# Altium schematic sheet Sheet1.SchDoc
size A4
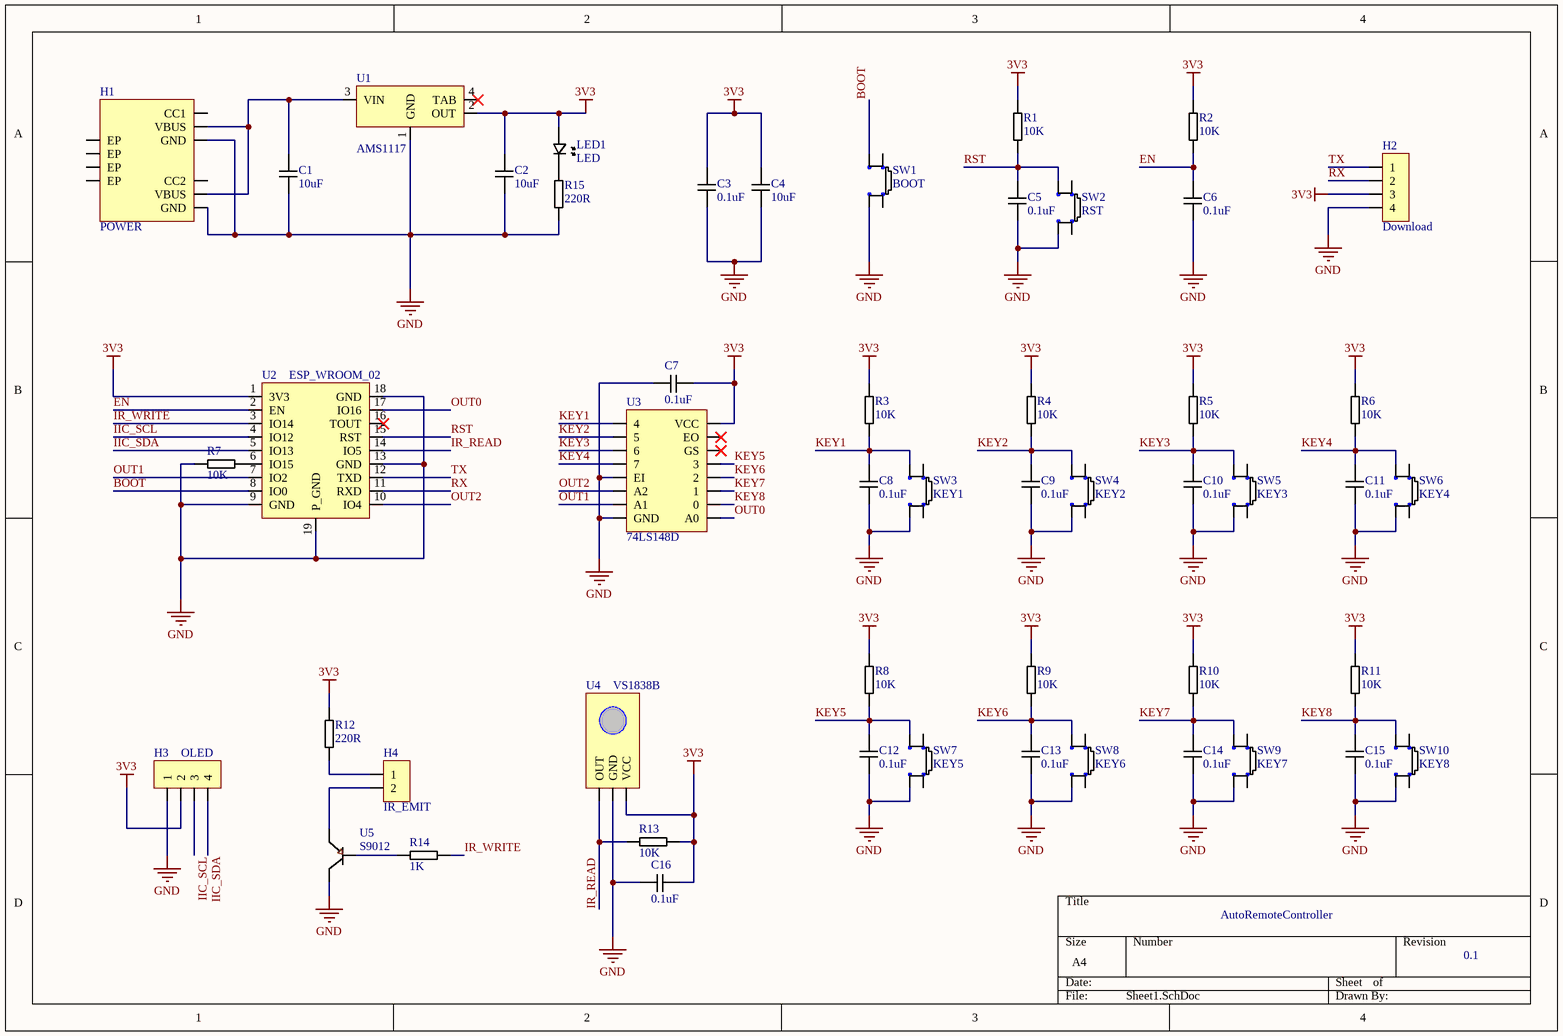
[diagram p0: Sheet1.SchDoc]

## Parts
C1  10uF  [Capacity_0805_SMD]
C2  10uF  [Capacity_0805_SMD]
C3  0.1uF  [Capacity_0805_SMD]
C4  10uF  [Capacity_0805_SMD]
C5  0.1uF  [Capacity_0805_SMD]
C6  0.1uF  [Capacity_0805_SMD]
C7  0.1uF  [Capacity_0805_SMD]
C8  0.1uF  [Capacity_0805_SMD]
C9  0.1uF  [Capacity_0805_SMD]
C10  0.1uF  [Capacity_0805_SMD]
C11  0.1uF  [Capacity_0805_SMD]
C12  0.1uF  [Capacity_0805_SMD]
C13  0.1uF  [Capacity_0805_SMD]
C14  0.1uF  [Capacity_0805_SMD]
C15  0.1uF  [Capacity_0805_SMD]
C16  0.1uF  [Capacity_0805_SMD]
H1  POWER  [TYPEC_SMD_6P]
H2  Download  [Header_2.54_1X4_TH]
H3  OLED  [Header_2.54_1X4_TH]
H4  IR_EMIT  [Header_2.54_1X2_TH]
LED1  LED  [LED_0805_SMD]
R1  10K  [Resistance_0805_SMD]
R2  10K  [Resistance_0805_SMD]
R3  10K  [Resistance_0805_SMD]
R4  10K  [Resistance_0805_SMD]
R5  10K  [Resistance_0805_SMD]
R6  10K  [Resistance_0805_SMD]
R7  10K  [Resistance_0805_SMD]
R8  10K  [Resistance_0805_SMD]
R9  10K  [Resistance_0805_SMD]
R10  10K  [Resistance_0805_SMD]
R11  10K  [Resistance_0805_SMD]
R12  220R  [Resistance_0805_SMD]
R13  10K  [Resistance_0805_SMD]
R14  1K  [Resistance_0805_SMD]
R15  220R  [Resistance_0805_SMD]
SW1  BOOT  [SW_6.0*6.0_SMD]
SW2  RST  [SW_6.0*6.0_SMD]
SW3  KEY1  [SW_6.0*6.0_SMD]
SW4  KEY2  [SW_6.0*6.0_SMD]
SW5  KEY3  [SW_6.0*6.0_SMD]
SW6  KEY4  [SW_6.0*6.0_SMD]
SW7  KEY5  [SW_6.0*6.0_SMD]
SW8  KEY6  [SW_6.0*6.0_SMD]
SW9  KEY7  [SW_6.0*6.0_SMD]
SW10  KEY8  [SW_6.0*6.0_SMD]
U1  AMS1117  [AMS1117]
U2  ESP_WROOM_02  [ESP_WROOM_02]
U3  74LS148D  [SOIC-16]
U4  VS1838B  [VS1838B]
U5  S9012  [SOT-23]

## Nets
3V3: C2.2 C3.2 C4.2 C7.1 C16.1 H2.3 H3.2 LED1.1 R1.2 R2.2 R3.2 R4.2 R5.2 R6.2 R8.2 R9.2 R10.2 R11.2 R12.2 R13.1 U1.2(OUT) U2.1(3V3) U3.16(VCC) U4.3(VCC)
GND: C1.1 C2.1 C3.1 C4.1 C5.1 C6.1 C7.2 C8.1 C9.1 C10.1 C11.1 C12.1 C13.1 C14.1 C15.1 C16.2 H1.A12(GND) H1.B12(GND) H2.4 H3.1 R7.2 R15.1 SW1.4 SW2.4 SW3.4 SW4.4 SW5.4 SW6.4 SW7.4 SW8.4 SW9.4 SW10.4 U1.1(GND) U2.9(GND) U2.13(GND) U2.18(GND) U2.19(P_GND) U3.5(EI) U3.8(GND) U4.2(GND) U5.3
BOOT: SW1.2 U2.8(IO0)
EN: C6.2 R2.1 U2.2(EN)
IIC_SCL: H3.3 U2.4(IO12)
IIC_SDA: H3.4 U2.5(IO13)
IR_READ: R13.2 U2.14(IO5) U4.1(OUT)
IR_WRITE: R14.2 U2.3(IO14)
KEY1: C8.2 R3.1 SW3.2 U3.1(4)
KEY2: C9.2 R4.1 SW4.2 U3.2(5)
KEY3: C10.2 R5.1 SW5.2 U3.3(6)
KEY4: C11.2 R6.1 SW6.2 U3.4(7)
KEY5: C12.2 R8.1 SW7.2 U3.13(3)
KEY6: C13.2 R9.1 SW8.2 U3.12(2)
KEY7: C14.2 R10.1 SW9.2 U3.11(1)
KEY8: C15.2 R11.1 SW10.2 U3.10(0)
OUT0: U2.17(IO16) U3.9(A0)
OUT1: U2.7(IO2) U3.7(A1)
OUT2: U2.10(IO4) U3.6(A2)
RST: C5.2 R1.1 SW2.2 U2.15(RST)
RX: H2.2 U2.11(RXD)
TX: H2.1 U2.12(TXD)
NetC1_2: C1.2 H1.A9(VBUS) H1.B9(VBUS) U1.3(VIN)
NetH4_1: H4.1 R12.1
NetH4_2: H4.2 U5.2
NetLED1_2: LED1.2 R15.2
NetR7_1: R7.1 U2.6(IO15)
NetR14_1: R14.1 U5.1

Not connected (* = marked no-connect by the designer): H1 1(EP) 2(EP) 3(EP) 4(EP) A5(CC1) B5(CC2); SW1 1 3; SW2 1 3; SW3 1 3; SW4 1 3; SW5 1 3; SW6 1 3; SW7 1 3; SW8 1 3; SW9 1 3; SW10 1 3; U1 4(TAB)*; U2 16(TOUT)*; U3 14(GS)* 15(EO)*

## Notes on the sheet
- AutoRemoteController
- 0.1
- Title
- Size:
- Date:
- A4
- Number:
- Time:
- Revision:
- Sheet
- of
- File:

## Library data of the parts
C1-C16 = Cap0805
H1 = TYPEC_6P_SMD
H2 H3 = Header_2.54mm_1X4_TH
H4 = Header_2.54mm_1X2_TH
LED1 = LED0805
R1-R15 = Res0805
SW1-SW10 = Key_6.0X6.0
U5 = S9012_PNP